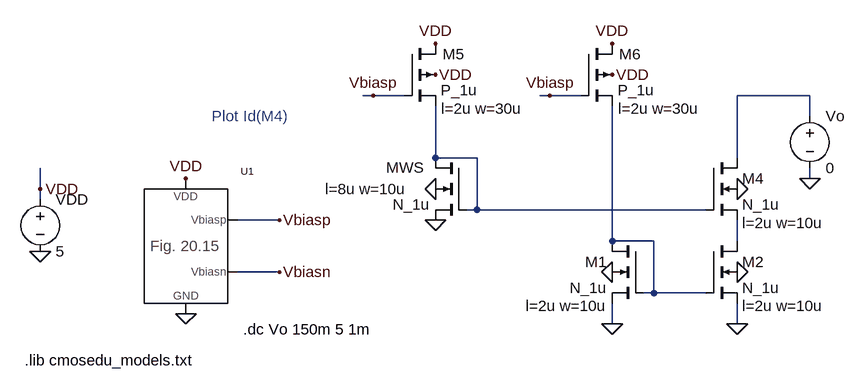
[diagram p0: schematic Fig20_33.asc]
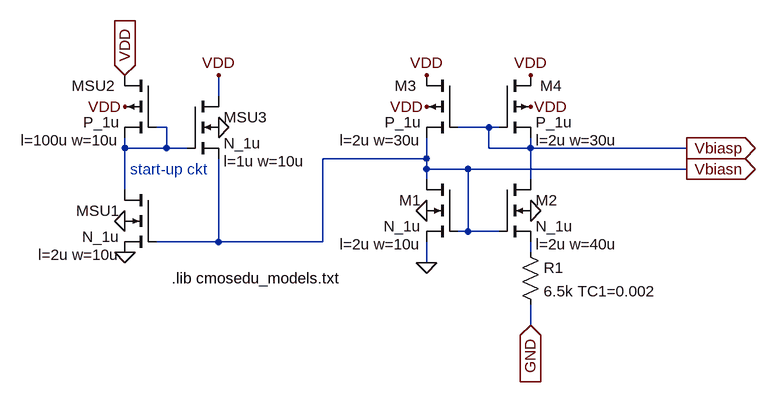
[diagram p1: sub-circuit fig_20_15.asc]
Fig20_33.asc, the LTspice schematic file:
Version 4
SHEET 1 1564 680
WIRE 288 -16 288 -48
WIRE 288 0 288 -16
WIRE 656 32 592 32
WIRE 656 112 592 112
WIRE 800 -160 784 -160
WIRE 848 -160 800 -160
WIRE 896 -64 896 -144
WIRE 960 -64 896 -64
WIRE 960 16 944 16
WIRE 960 16 960 -64
WIRE 1072 -160 1056 -160
WIRE 1120 -160 1072 -160
WIRE 1168 64 1168 -144
WIRE 1168 192 1168 160
WIRE 1232 64 1168 64
WIRE 1232 144 1216 144
WIRE 1232 144 1232 64
WIRE 1312 16 960 16
WIRE 1312 144 1232 144
WIRE 1360 -64 1360 -160
WIRE 1360 64 1360 32
WIRE 1360 192 1360 160
WIRE 1472 -160 1360 -160
WIRE 1472 -128 1472 -160
WIRE 1472 -32 1472 -48
FLAG 288 80 0
FLAG 288 -16 VDD
FLAG 512 -32 VDD
FLAG 512 176 0
FLAG 656 32 Vbiasp
FLAG 656 112 Vbiasn
FLAG 1168 112 0
FLAG 1168 192 0
FLAG 1472 -32 0
FLAG 896 -16 0
FLAG 1360 112 0
FLAG 1360 192 0
FLAG 1360 -16 0
FLAG 896 -192 VDD
FLAG 896 -240 VDD
FLAG 800 -160 Vbiasp
FLAG 896 32 0
FLAG 1168 -192 VDD
FLAG 1168 -240 VDD
FLAG 1072 -160 Vbiasp
SYMBOL voltage 288 -16 R0
WINDOW 123 0 0 Left 0
WINDOW 39 0 0 Left 0
SYMATTR InstName VDD
SYMATTR Value 5
SYMBOL nmos4 1216 64 M0
WINDOW 123 56 100 Left 0
SYMATTR Value2 l=2u w=10u
SYMATTR InstName M1
SYMATTR Value N_1u
SYMBOL voltage 1472 -144 R0
SYMATTR InstName Vo
SYMATTR Value 0
SYMBOL Fig_20_15 448 80 R0
SYMATTR InstName U1
SYMBOL nmos4 944 -64 M0
WINDOW 123 92 48 Left 0
WINDOW 0 65 15 Left 0
SYMATTR Value2 l=8u w=10u
SYMATTR InstName MWS
SYMATTR Value N_1u
SYMBOL nmos4 1312 64 R0
WINDOW 123 56 100 Left 0
SYMATTR Value2 l=2u w=10u
SYMATTR InstName M2
SYMATTR Value N_1u
SYMBOL nmos4 1312 -64 R0
WINDOW 123 56 100 Left 0
SYMATTR Value2 l=2u w=10u
SYMATTR InstName M4
SYMATTR Value N_1u
SYMBOL pmos4 848 -240 R0
WINDOW 0 59 16 Left 0
WINDOW 123 57 100 Left 0
SYMATTR InstName M5
SYMATTR Value2 l=2u w=30u
SYMATTR Value P_1u
SYMBOL pmos4 1120 -240 R0
WINDOW 0 59 16 Left 0
WINDOW 123 57 100 Left 0
SYMATTR InstName M6
SYMATTR Value2 l=2u w=30u
SYMATTR Value P_1u
TEXT 264 248 Left 0 !.lib cmosedu_models.txt
TEXT 552 -128 Left 0 ;Plot Id(M4)
TEXT 600 200 Left 0 !.dc Vo 150m 5 1m

fig_20_15.asc, the sub-circuit schematic file:
Version 4
SHEET 1 1548 680
WIRE 544 16 544 0
WIRE 544 80 544 16
WIRE 544 176 544 160
WIRE 608 -16 592 -16
WIRE 608 16 544 16
WIRE 608 16 608 -16
WIRE 640 16 608 16
WIRE 688 -64 688 -96
WIRE 688 160 592 160
WIRE 688 160 688 32
WIRE 848 160 688 160
WIRE 848 160 848 32
WIRE 1008 32 848 32
WIRE 1008 32 1008 0
WIRE 1008 48 1008 32
WIRE 1008 64 1008 48
WIRE 1008 192 1008 160
WIRE 1072 48 1008 48
WIRE 1072 144 1056 144
WIRE 1072 144 1072 48
WIRE 1104 -16 1056 -16
WIRE 1104 16 1104 -16
WIRE 1120 -16 1104 -16
WIRE 1120 144 1072 144
WIRE 1168 16 1104 16
WIRE 1168 16 1168 0
WIRE 1168 64 1168 16
WIRE 1168 176 1168 160
WIRE 1168 288 1168 256
WIRE 1408 16 1168 16
WIRE 1408 48 1072 48
FLAG 544 -48 VDD
FLAG 544 128 0
FLAG 688 -16 0
FLAG 688 -96 VDD
FLAG 1008 -48 VDD
FLAG 1008 -96 VDD
FLAG 1168 -48 VDD
FLAG 1168 -96 VDD
FLAG 1008 192 0
FLAG 1008 112 0
FLAG 1168 112 0
FLAG 544 -96 VDD
IOPIN 544 -96 In
FLAG 544 176 0
FLAG 1408 16 Vbiasp
IOPIN 1408 16 Out
FLAG 1408 48 Vbiasn
IOPIN 1408 48 Out
FLAG 1168 288 GND
IOPIN 1168 288 In
SYMBOL pmos4 592 -96 M0
WINDOW 0 63 16 Left 0
WINDOW 123 56 100 Left 0
SYMATTR InstName MSU2
SYMATTR Value2 l=100u w=10u
SYMATTR Value P_1u
SYMBOL nmos4 592 80 M0
WINDOW 123 56 100 Left 0
SYMATTR Value2 l=2u w=10u
SYMATTR InstName MSU1
SYMATTR Value N_1u
SYMBOL nmos4 640 -64 R0
WINDOW 123 56 100 Left 0
SYMATTR Value2 l=1u w=10u
SYMATTR InstName MSU3
SYMATTR Value N_1u
SYMBOL pmos4 1056 -96 M0
WINDOW 0 63 16 Left 0
WINDOW 123 56 100 Left 0
SYMATTR InstName M3
SYMATTR Value2 l=2u w=30u
SYMATTR Value P_1u
SYMBOL pmos4 1120 -96 R0
WINDOW 0 63 16 Left 0
WINDOW 123 56 100 Left 0
SYMATTR InstName M4
SYMATTR Value2 l=2u w=30u
SYMATTR Value P_1u
SYMBOL nmos4 1056 64 M0
WINDOW 123 56 100 Left 0
SYMATTR Value2 l=2u w=10u
SYMATTR InstName M1
SYMATTR Value N_1u
SYMBOL nmos4 1120 64 R0
WINDOW 123 56 100 Left 0
SYMATTR Value2 l=2u w=40u
SYMATTR InstName M2
SYMATTR Value N_1u
SYMBOL res 1152 160 R0
SYMATTR InstName R1
SYMATTR Value 6.5k TC1=0.002
TEXT 552 48 Left 0 ;start-up ckt
TEXT 616 216 Left 0 !.lib cmosedu_models.txt

The netlist it stands for:
* Fig20_33.asc
VDD VDD 0 5
M1 N002 N002 0 0 N_1u l=2u w=10u
Vo N003 0 0
XU1 Vbiasn Vbiasp VDD 0 fig_20_15
MWS N001 N001 0 0 N_1u l=8u w=10u
M2 N004 N002 0 0 N_1u l=2u w=10u
M4 N003 N001 N004 0 N_1u l=2u w=10u
M5 VDD Vbiasp N001 VDD P_1u l=2u w=30u
M6 VDD Vbiasp N002 VDD P_1u l=2u w=30u

* block symbol definitions
.subckt fig_20_15 Vbiasn Vbiasp VDD GND
MSU2 VDD N001 N001 VDD P_1u l=100u w=10u
MSU1 N001 Vbiasn 0 0 N_1u l=2u w=10u
MSU3 VDD N001 Vbiasn 0 N_1u l=1u w=10u
M3 VDD Vbiasp Vbiasn VDD P_1u l=2u w=30u
M4 VDD Vbiasp Vbiasp VDD P_1u l=2u w=30u
M1 Vbiasn Vbiasn 0 0 N_1u l=2u w=10u
M2 Vbiasp Vbiasn N002 0 N_1u l=2u w=40u
R1 N002 GND 6.5k TC1=0.002
* start-up ckt
.lib cmosedu_models.txt
.ends fig_20_15

.model NMOS NMOS
.model PMOS PMOS
.lib standard.mos
.lib cmosedu_models.txt
* Plot Id(M4)
.dc Vo 150m 5 1m
.backanno
.end